# Altium schematic sheet Schematic.SchDoc
size A
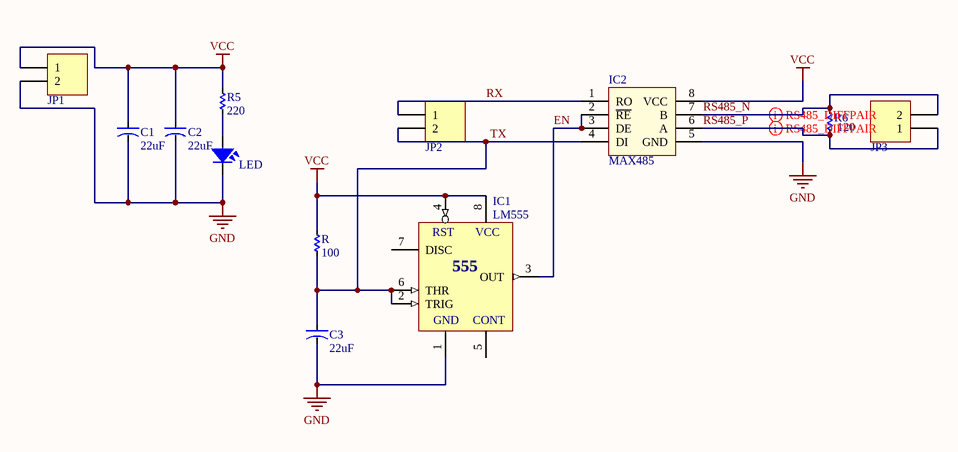
[diagram p0: Schematic.SchDoc]

## Parts
C1  22uF  [CA-ALU-2.54]
C2  22uF  [CA-ALU-2.54]
C3  22uF  [CA-ALU-2.54]
IC1  LM555  [DIP8]
IC2  MAX485  [DIP8/W0.3]
JP1  Header 2_1  [HED2]  (value not drawn)
JP2  Header 2_1  [HED2]  (value not drawn)
JP3  Header 2_1  [HED2]  (value not drawn)
LED  LED  [LED-5-Green]  (value not drawn)
R  100  [RES-1/4W]
R5  220  [RES-1/4W]
R6  120  [RES-1/4W]

## Nets
GND: C1.2 C2.2 C3.2 IC1.1(GND) IC2.5(GND) JP1.2 LED.2
VCC: C1.1 C2.1 IC1.4(RST) IC1.8(VCC) IC2.8(VCC) JP1.1 R.1 R5.1
EN: IC1.3(OUT) IC2.2(~{RE}) IC2.3(DE)
RS485_N: IC2.7(B) JP3.2 R6.1
RS485_P: IC2.6(A) JP3.1 R6.2
RX: IC2.1(RO) JP2.1
TX: C3.1 IC1.2(TRIG) IC1.6(THR) IC2.4(DI) JP2.2 R.2
NetLED_1: LED.1 R5.2

Not connected (* = marked no-connect by the designer): IC1 5(CONT) 7(DISC)

## Layout directives
differential pair; differential pair class RS485_DIFFPAIR: RS485_N, RS485_P

## Notes on the sheet
- (in symbol LM555) 555

## Library data of the parts
C1-C3 = CN-ALU-DIP: Capacitor (Semiconductor SIM Model); Value: 104; LatestRevisionDate: 17-Jul-2002; LatestRevisionNote: Re-released for DXP Platform.; PackageReference: C1206; Publisher: Altium Limited
IC1 = LM555: Timer; Value: LM555
IC2 = MAX485: RS232 - RS485 (Same sn75176)
JP1-JP3 = Header 2_1: Header, 2-Pin; Manufacturer: Generic Components; Class: Connector; Value: Header 2
LED = LED: LED Single colour Green and Red; Value: LED 3 ly Single Colour
R R5 R6 = Res: Manufacturer: Generic Components; Class: Passive; SubClass: R; Published: 08/06/2000; Publisher: Altium Hobart Technology Centre